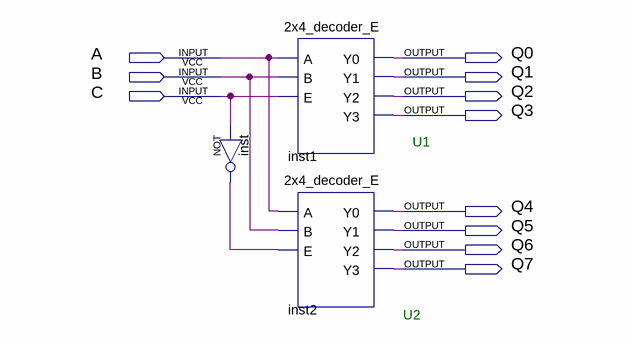
[diagram p0: schematic sheet]
// Quartus schematic 3x8_decoder_S.bdf as structural Verilog: 3 symbols, 11 pins
module \3x8_decoder_S  (
  input  A,
  input  B,
  input  C,
  output Q0,
  output Q1,
  output Q2,
  output Q3,
  output Q4,
  output Q5,
  output Q6,
  output Q7
);

  wire inst_out;

  not inst (inst_out, C);
  \2x4_decoder_E  inst1 (.A(A), .B(B), .E(C), .Y0(Q0), .Y1(Q1), .Y2(Q2), .Y3(Q3));
  \2x4_decoder_E  inst2 (.A(A), .B(B), .E(inst_out), .Y0(Q4), .Y1(Q5), .Y2(Q6), .Y3(Q7));

  // Notes on the sheet:
  //   U1
  //   U2
endmodule
